# Altium schematic sheet Schematic.SchDoc
size 297 x 209 mm
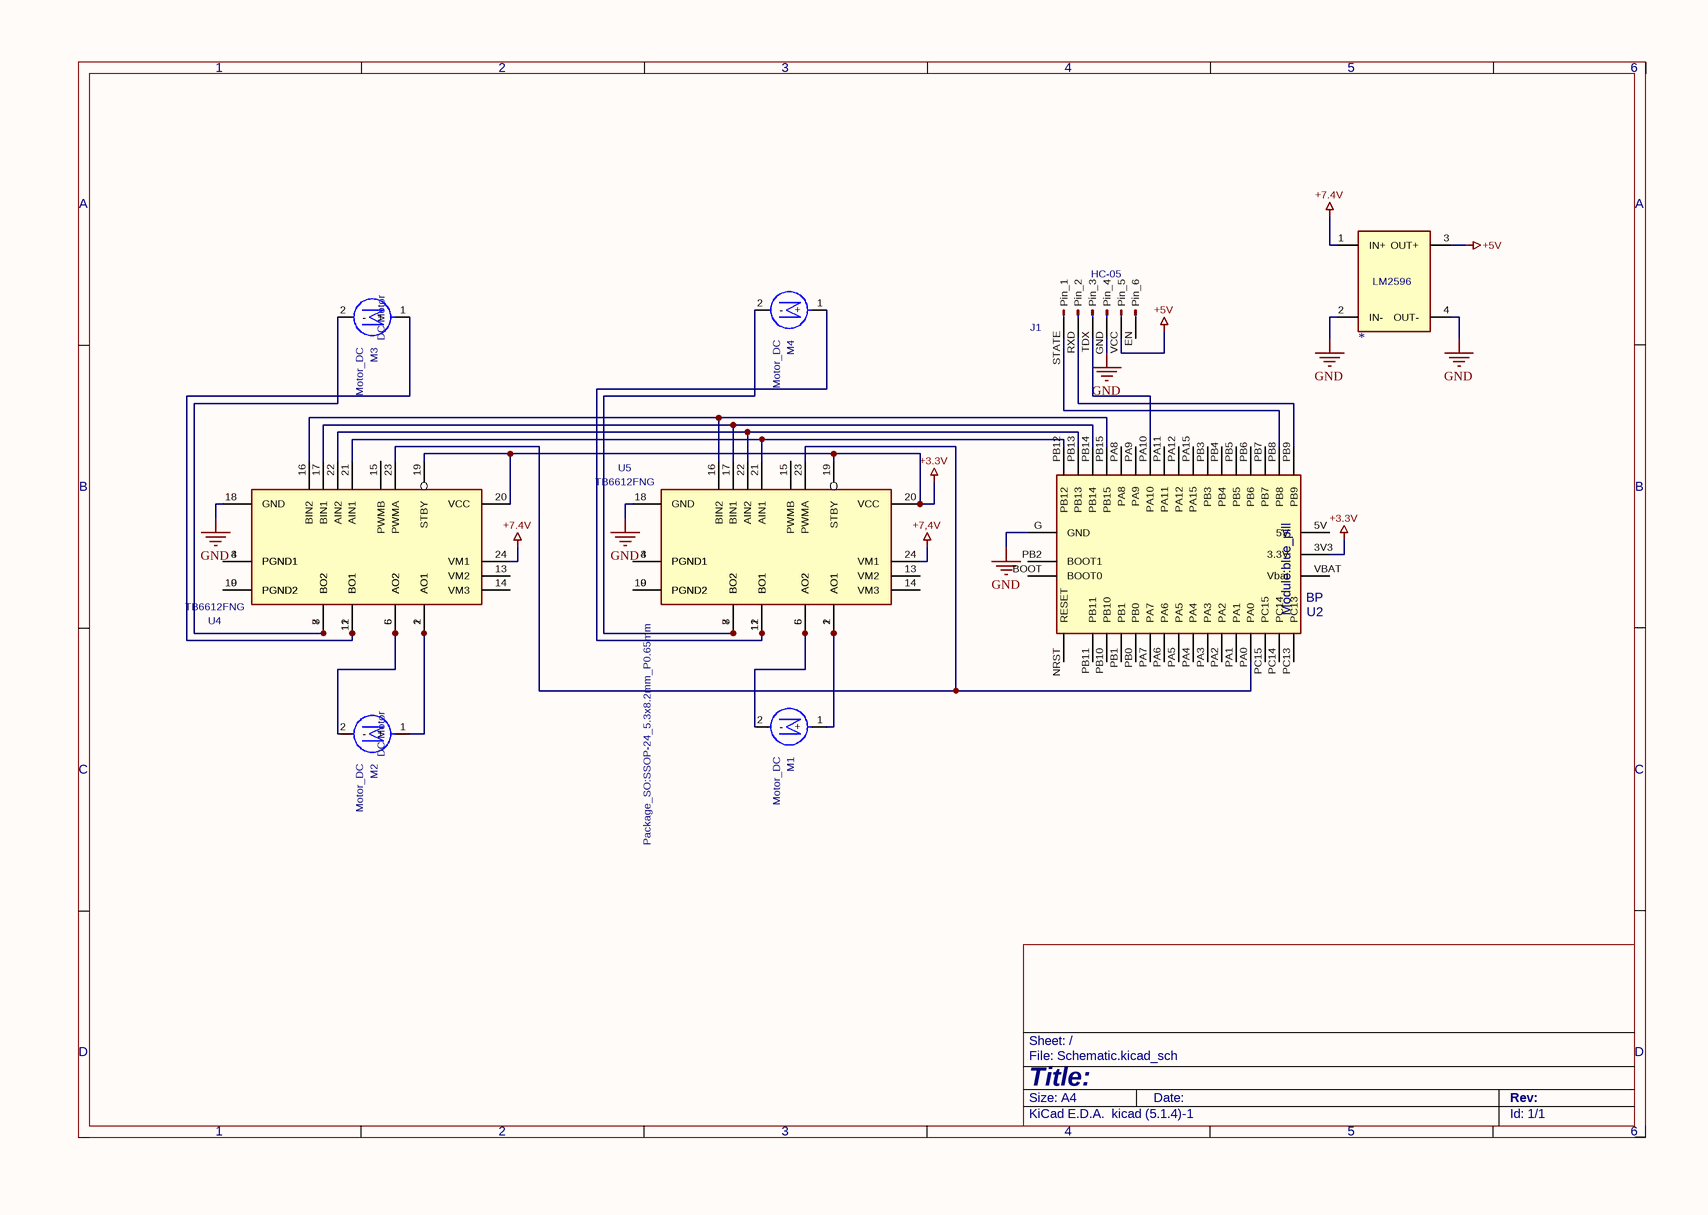
[diagram p0: Schematic.SchDoc]

## Parts
J1  HC-05
LM2596  *
M1  Motor_DC
M2  Description: DC Motor  (hidden comment: Motor_DC)
M3  Description: DC Motor  (hidden comment: Motor_DC)
M4  Motor_DC
U2  Footprint: Module:blue_pill  [blue_pill]  (hidden comment: BP)
U4  TB6612FNG  [SSOP-24_5.3x8.2mm_P0.65mm]
U5  Footprint: Package_SO:SSOP-24_5.3x8.2mm_P0.65mm  [SSOP-24_5.3x8.2mm_P0.65mm]  (hidden comment: TB6612FNG)

## Nets
+3.3V: U2.3V3(3.3V) U4.19(STBY) U4.20(VCC) U5.19(STBY) U5.20(VCC)
+5V: J1.VCC(Pin_5) LM2596.3(OUT+)
+7,4V: U5.24(VM1)
+7.4V: LM2596.1(IN+) U4.24(VM1)
GND: J1.GND(Pin_4) LM2596.2(IN-) LM2596.4(OUT-) U2.G(GND) U4.18(GND) U5.18(GND)
NetJ1_RXD: J1.RXD(Pin_2) U2.PB9
NetJ1_STATE: J1.STATE(Pin_1) U2.PB8
NetJ1_TDX: J1.TDX(Pin_3) U2.PA10
NetM1_1: M1.1(+) U5.1(AO1) U5.2(AO1)
NetM1_2: M1.2(-) U5.5(AO2) U5.6(AO2)
NetM2_1: M2.1(+) U4.1(AO1) U4.2(AO1)
NetM2_2: M2.2(-) U4.5(AO2) U4.6(AO2)
NetM3_1: M3.1(+) U4.11(BO1) U4.12(BO1)
NetM3_2: M3.2(-) U4.7(BO2) U4.8(BO2)
NetM4_1: M4.1(+) U5.11(BO1) U5.12(BO1)
NetM4_2: M4.2(-) U5.7(BO2) U5.8(BO2)
NetU2_PA0: U2.PA0 U4.23(PWMA) U5.23(PWMA)
NetU2_PB12: U2.PB12 U4.21(AIN1) U5.21(AIN1)
NetU2_PB13: U2.PB13 U4.22(AIN2) U5.22(AIN2)
NetU2_PB14: U2.PB14 U4.17(BIN1) U5.17(BIN1)
NetU2_PB15: U2.PB15 U4.16(BIN2) U5.16(BIN2)
NetU4_3: U4.3(PGND1) U4.4(PGND1)
NetU4_9: U4.9(PGND2) U4.10(PGND2)
NetU5_3: U5.3(PGND1) U5.4(PGND1)
NetU5_9: U5.9(PGND2) U5.10(PGND2)

Not connected (* = marked no-connect by the designer): J1 EN(Pin_6); U2 5V BOOT(BOOT0) NRST(RESET) PA1 PA2 PA3 PA4 PA5 PA6 PA7 PA8 PA9 PA11 PA12 PA15 PB0 PB1 PB2(BOOT1) PB3 PB4 PB5 PB6 PB7 PB10 PB11 PC13 PC14 PC15 VBAT(Vbat); U4 13(VM2) 14(VM3) 15(PWMB); U5 13(VM2) 14(VM3) 15(PWMB)

## Notes on the sheet
- 1
- 2
- 3
- 4
- 5
- 6
- A
- B
- C
- D
- Title:
- File: Schematic.kicad_sch
- Sheet: /
- KiCad E.D.A.  kicad (5.1.4)-1
- Size: A4
- Date:
- Rev:
- Id: 1/1

## Library data of the parts
J1 = Conn_01x06_Pin: Value: HC-05
LM2596 = LM2596_Module
M1-M4 = Motor_DC: Value: Motor_DC
U2 = BP: Value: BP
U4 U5 = TB6612FNG: Value: TB6612FNG